# EAGLE design frienship_1 (EAGLE 6.1)
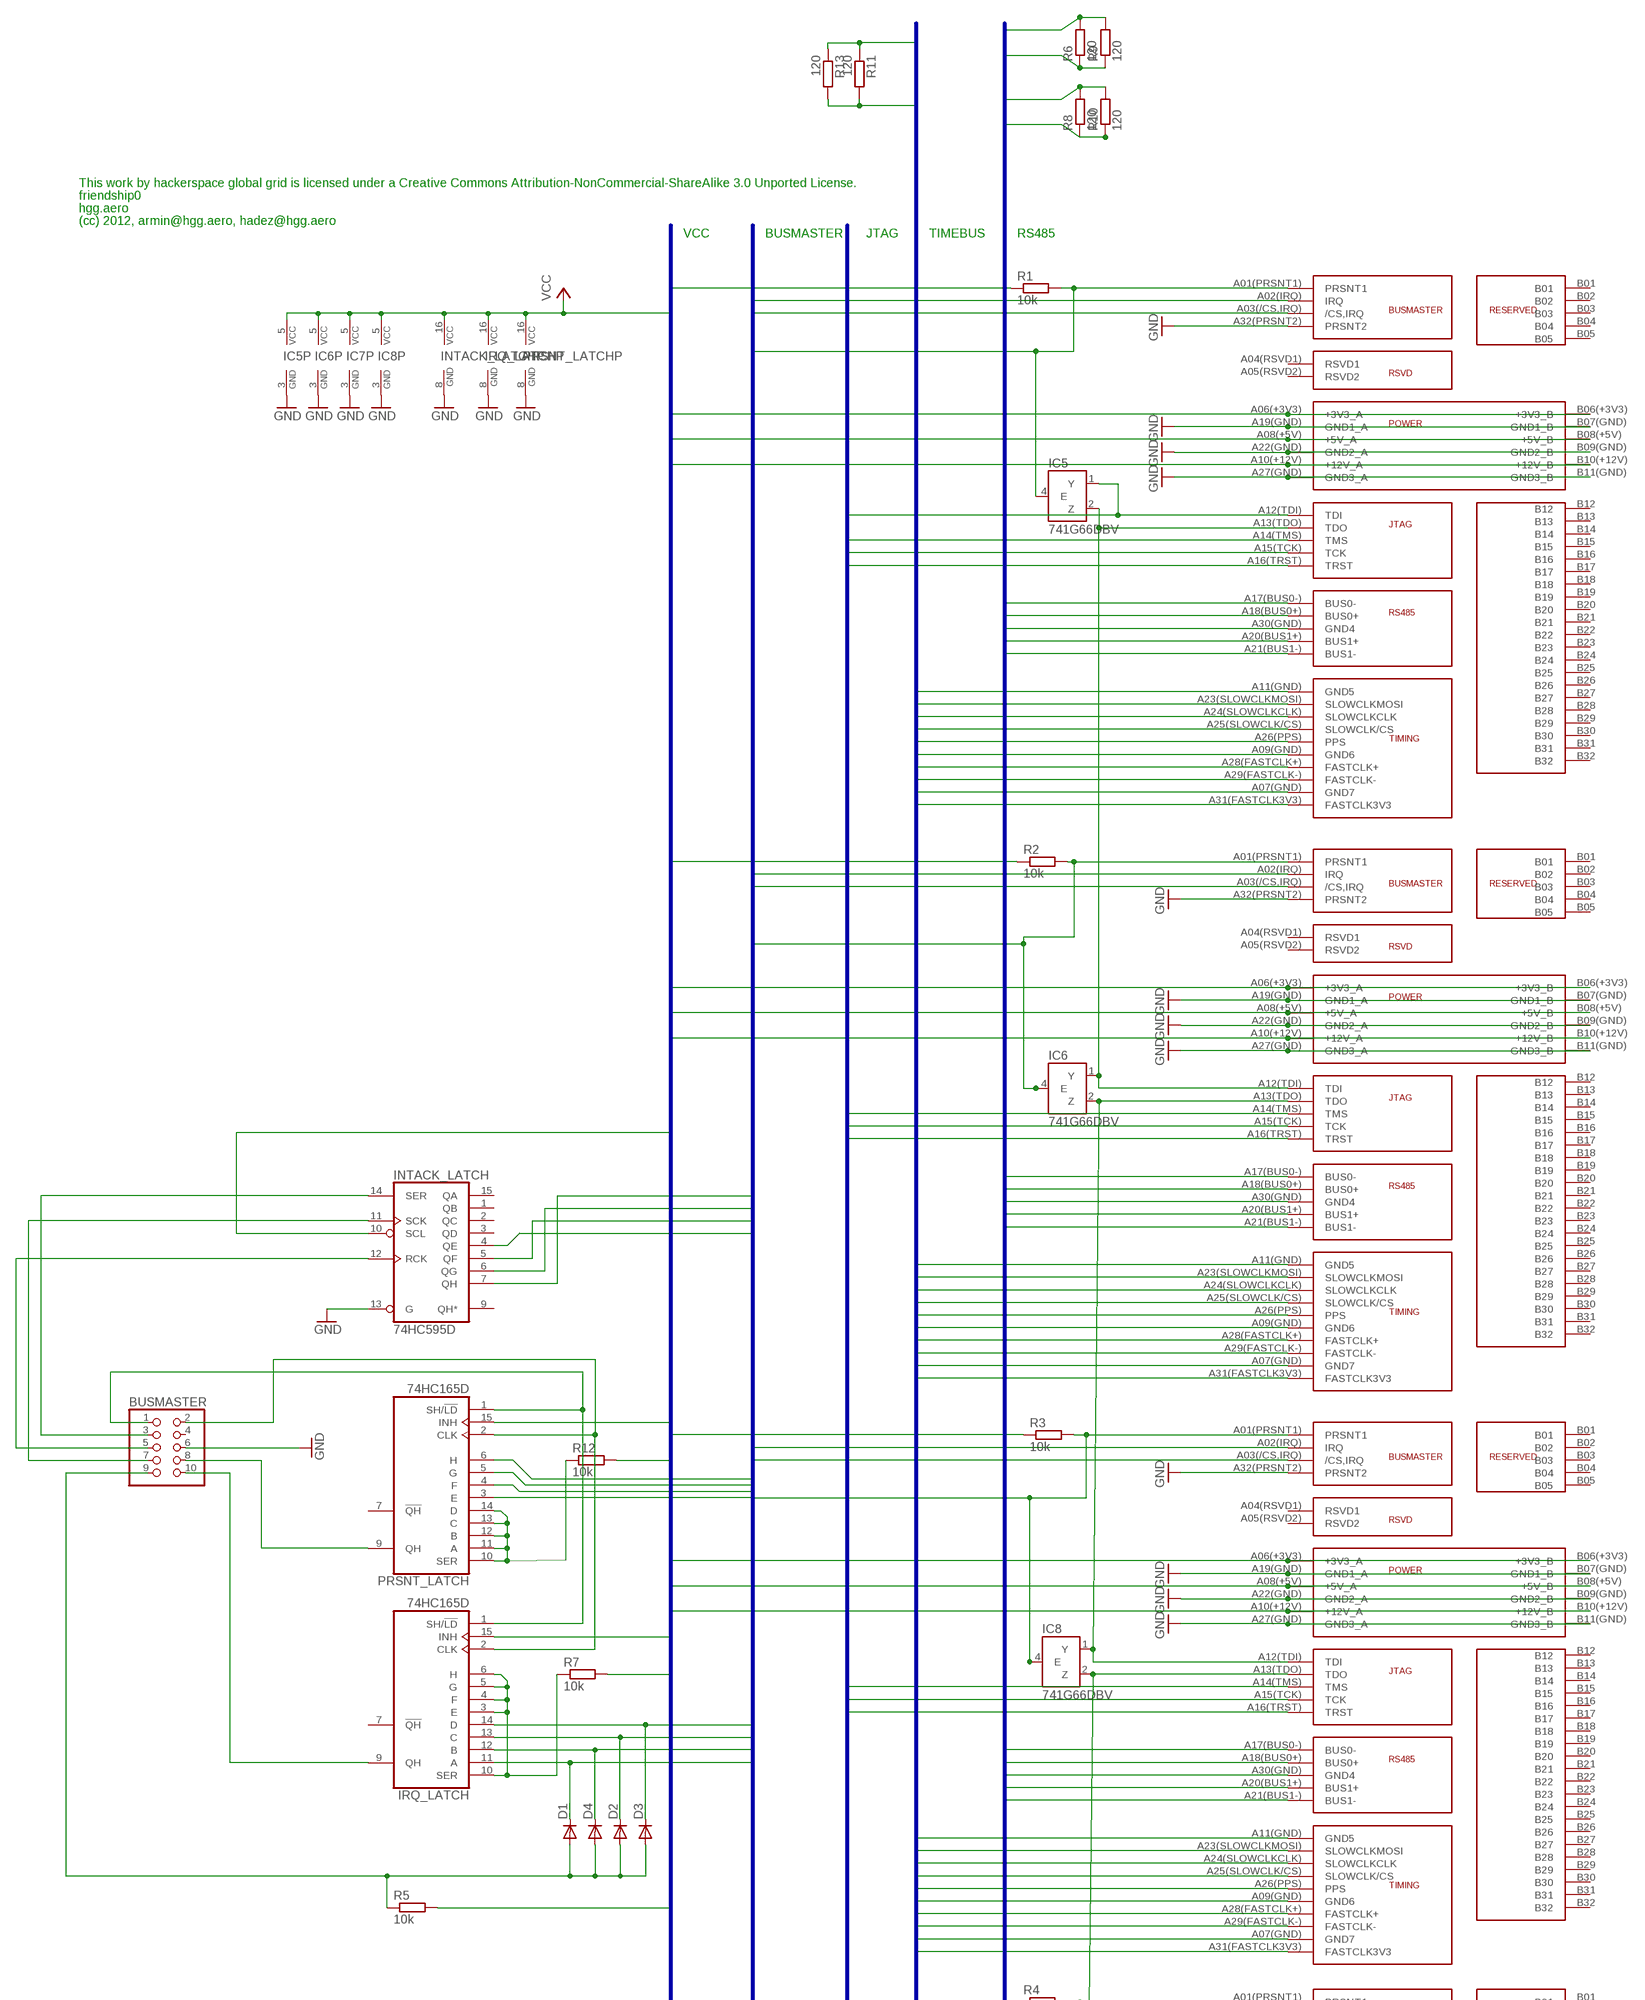
[diagram p0: schematic, sheet 1, part 1 of 2]
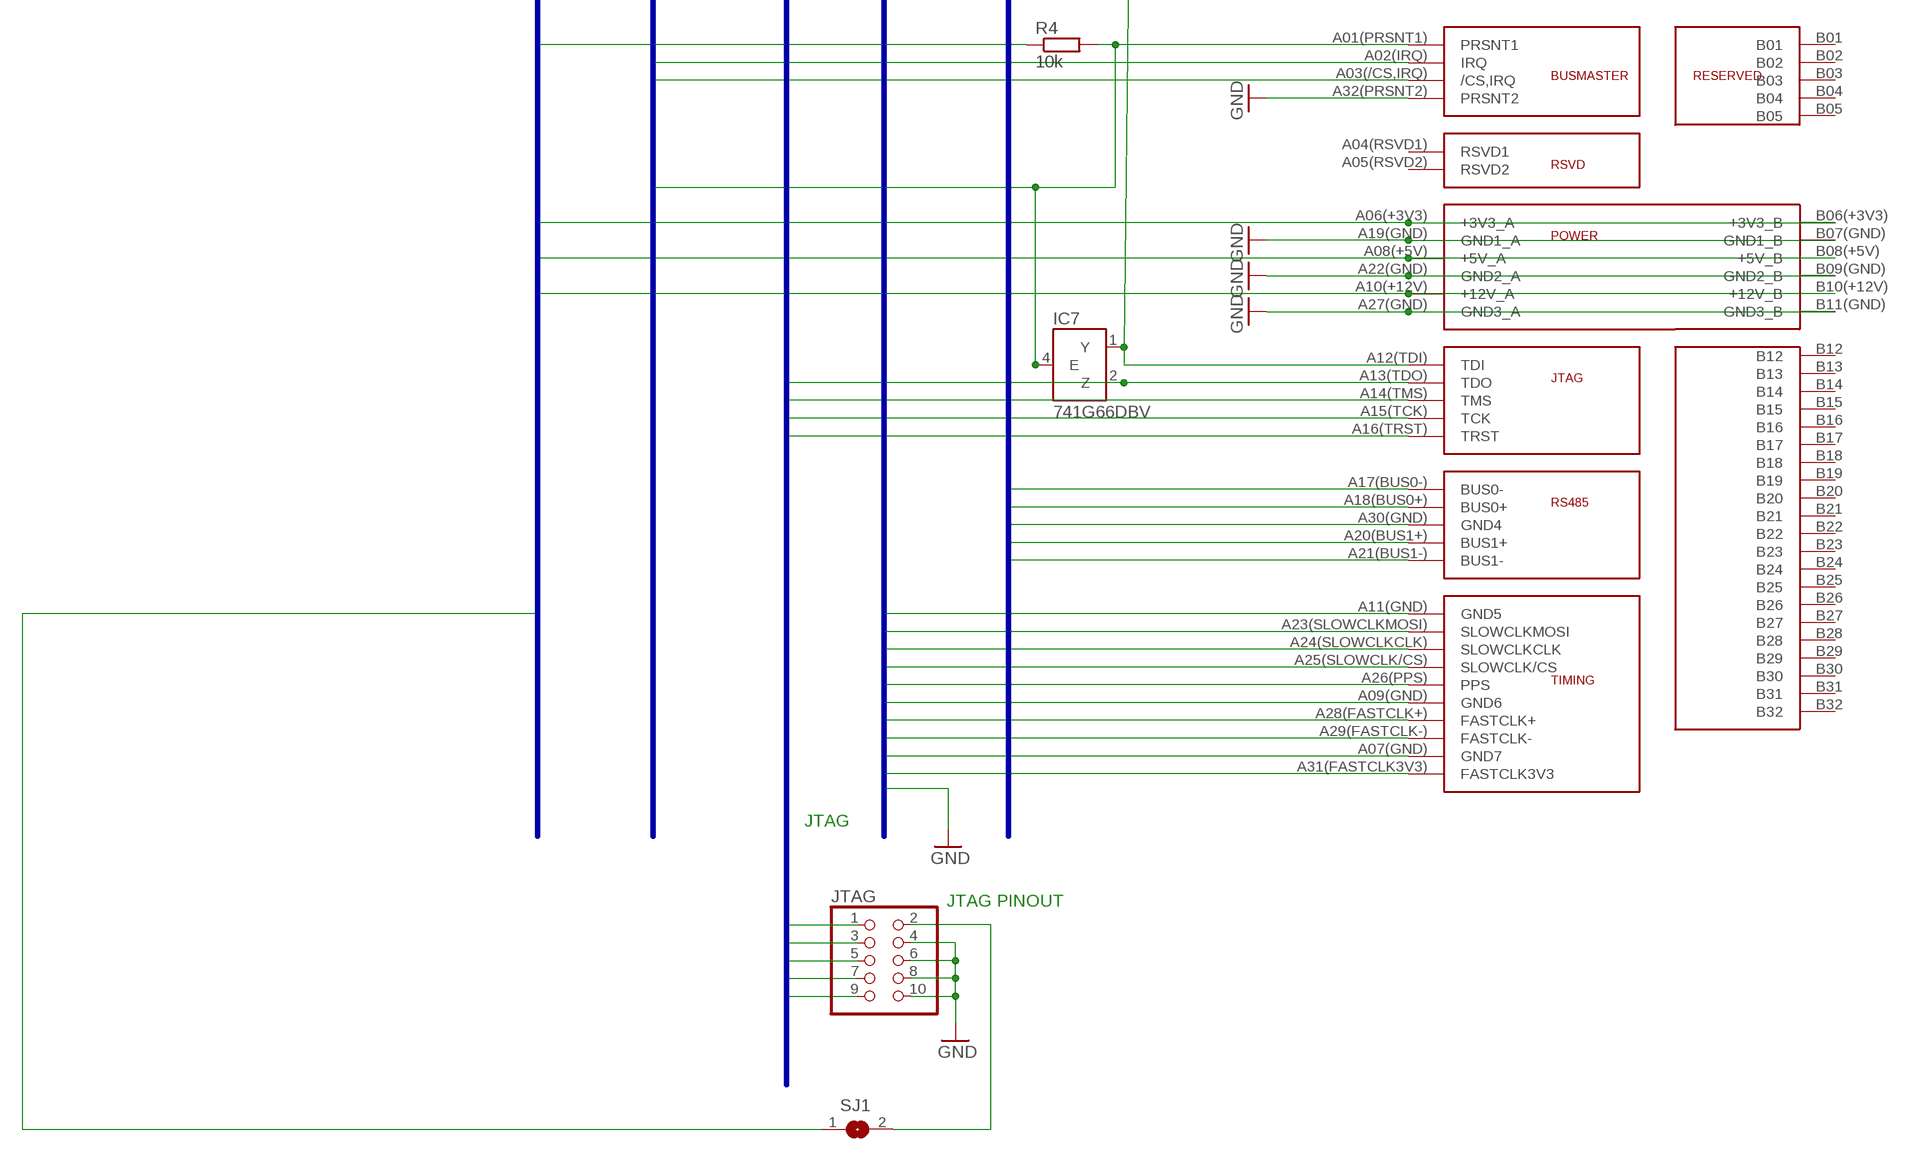
[diagram p1: schematic, sheet 1, part 2 of 2]

## Parts
BUSMASTER  PINHD-2X5  [2X05]
D1  DIODE-SOD80C  [SOD80C]
D2  DIODE-SOD80C  [SOD80C]
D3  DIODE-SOD80C  [SOD80C]
D4  DIODE-SOD80C  [SOD80C]
IC5  741G66DBV  [SOT23-5]
IC6  741G66DBV  [SOT23-5]
IC7  741G66DBV  [SOT23-5]
IC8  741G66DBV  [SOT23-5]
INTACK_LATCH  74HC595D  [SO16]
IRQ_LATCH  74HC165D  [SO16]
JTAG  PINHD-2X5  [2X05]
PORT0  FRIENDSHIPSLOT  [FRIENDSHIP_SLOT]
PORT1  FRIENDSHIPSLOT  [FRIENDSHIP_SLOT]
PORT2  FRIENDSHIPSLOT  [FRIENDSHIP_SLOT]
PORT3  FRIENDSHIPSLOT  [FRIENDSHIP_SLOT]
PRSNT_LATCH  74HC165D  [SO16]
R1  10k  R-EU_R0603  [R0603]
R2  10k  R-EU_R0603  [R0603]
R3  10k  R-EU_R0603  [R0603]
R4  10k  R-EU_R0603  [R0603]
R5  10k  R-EU_R0603  [R0603]
R6  120  R-EU_R0603  [R0603]
R7  10k  R-EU_R0603  [R0603]
R8  120  R-EU_R0603  [R0603]
R9  120  R-EU_R0603  [R0603]
R10  120  R-EU_R0603  [R0603]
R11  120  R-EU_R0603  [R0603]
R12  10k  R-EU_R0603  [R0603]
R13  120  R-EU_R0603  [R0603]
SJ1  SJ  [SJ]

## Nets
3V3: IC5.5(VCC) IC6.5(VCC) IC7.5(VCC) IC8.5(VCC) INTACK_LATCH.10(SCL) INTACK_LATCH.16(VCC) IRQ_LATCH.15(INH) IRQ_LATCH.16(VCC) PORT0.A06(+3V3)(+3V3_A) PORT0.B06(+3V3)(+3V3_B) PORT1.A06(+3V3)(+3V3_A) PORT1.B06(+3V3)(+3V3_B) PORT2.A06(+3V3)(+3V3_A) PORT2.B06(+3V3)(+3V3_B) PORT3.A06(+3V3)(+3V3_A) PORT3.B06(+3V3)(+3V3_B) PRSNT_LATCH.15(INH) PRSNT_LATCH.16(VCC) R1.1 R2.1 R3.1 R4.1 R5.2 R7.2 R12.2 SJ1.1 ; supply symbol labelled VCC
5V: PORT0.A08(+5V)(+5V_A) PORT0.B08(+5V)(+5V_B) PORT1.A08(+5V)(+5V_A) PORT1.B08(+5V)(+5V_B) PORT2.A08(+5V)(+5V_A) PORT2.B08(+5V)(+5V_B) PORT3.A08(+5V)(+5V_A) PORT3.B08(+5V)(+5V_B)
12V: PORT0.A10(+12V)(+12V_A) PORT0.B10(+12V)(+12V_B) PORT1.A10(+12V)(+12V_A) PORT1.B10(+12V)(+12V_B) PORT2.A10(+12V)(+12V_A) PORT2.B10(+12V)(+12V_B) PORT3.A10(+12V)(+12V_A) PORT3.B10(+12V)(+12V_B)
/CS: PORT0.A25(SLOWCLK/CS)(SLOWCLK/CS) PORT1.A25(SLOWCLK/CS)(SLOWCLK/CS) PORT2.A25(SLOWCLK/CS)(SLOWCLK/CS) PORT3.A25(SLOWCLK/CS)(SLOWCLK/CS)
/CS0: INTACK_LATCH.7(QH) PORT0.A03(/CS,IRQ)(/CS,IRQ)
/CS1: INTACK_LATCH.6(QG) PORT1.A03(/CS,IRQ)(/CS,IRQ)
/CS2: INTACK_LATCH.5(QF) PORT2.A03(/CS,IRQ)(/CS,IRQ)
/CS3: INTACK_LATCH.4(QE) PORT3.A03(/CS,IRQ)(/CS,IRQ)
CLK: PORT0.A24(SLOWCLKCLK)(SLOWCLKCLK) PORT1.A24(SLOWCLKCLK)(SLOWCLKCLK) PORT2.A24(SLOWCLKCLK)(SLOWCLKCLK) PORT3.A24(SLOWCLKCLK)(SLOWCLKCLK)
FASTCLK3V3: PORT0.A31(FASTCLK3V3)(FASTCLK3V3) PORT1.A31(FASTCLK3V3)(FASTCLK3V3) PORT2.A31(FASTCLK3V3)(FASTCLK3V3) PORT3.A31(FASTCLK3V3)(FASTCLK3V3)
FASTCLK+: PORT0.A28(FASTCLK+)(FASTCLK+) PORT1.A28(FASTCLK+)(FASTCLK+) PORT2.A28(FASTCLK+)(FASTCLK+) PORT3.A28(FASTCLK+)(FASTCLK+) R11.1 R13.1
FASTCLK-: PORT0.A29(FASTCLK-)(FASTCLK-) PORT1.A29(FASTCLK-)(FASTCLK-) PORT2.A29(FASTCLK-)(FASTCLK-) PORT3.A29(FASTCLK-)(FASTCLK-) R11.2 R13.2
GND: BUSMASTER.6 IC5.3(GND) IC6.3(GND) IC7.3(GND) IC8.3(GND) INTACK_LATCH.8(GND) INTACK_LATCH.13(G) IRQ_LATCH.8(GND) JTAG.4 JTAG.6 JTAG.8 JTAG.10 PORT0.A07(GND)(GND7) PORT0.A09(GND)(GND6) PORT0.A11(GND)(GND5) PORT0.A19(GND)(GND1_A) PORT0.A22(GND)(GND2_A) PORT0.A27(GND)(GND3_A) PORT0.A30(GND)(GND4) PORT0.A32(PRSNT2)(PRSNT2) PORT0.B07(GND)(GND1_B) PORT0.B09(GND)(GND2_B) PORT0.B11(GND)(GND3_B) PORT1.A07(GND)(GND7) PORT1.A09(GND)(GND6) PORT1.A11(GND)(GND5) PORT1.A19(GND)(GND1_A) PORT1.A22(GND)(GND2_A) PORT1.A27(GND)(GND3_A) PORT1.A30(GND)(GND4) PORT1.A32(PRSNT2)(PRSNT2) PORT1.B07(GND)(GND1_B) PORT1.B09(GND)(GND2_B) PORT1.B11(GND)(GND3_B) PORT2.A07(GND)(GND7) PORT2.A09(GND)(GND6) PORT2.A11(GND)(GND5) PORT2.A19(GND)(GND1_A) PORT2.A22(GND)(GND2_A) PORT2.A27(GND)(GND3_A) PORT2.A30(GND)(GND4) PORT2.A32(PRSNT2)(PRSNT2) PORT2.B07(GND)(GND1_B) PORT2.B09(GND)(GND2_B) PORT2.B11(GND)(GND3_B) PORT3.A07(GND)(GND7) PORT3.A09(GND)(GND6) PORT3.A11(GND)(GND5) PORT3.A19(GND)(GND1_A) PORT3.A22(GND)(GND2_A) PORT3.A27(GND)(GND3_A) PORT3.A30(GND)(GND4) PORT3.A32(PRSNT2)(PRSNT2) PORT3.B07(GND)(GND1_B) PORT3.B09(GND)(GND2_B) PORT3.B11(GND)(GND3_B) PRSNT_LATCH.8(GND)
IRQ0: D3.C IRQ_LATCH.14(D) PORT0.A02(IRQ)(IRQ)
IRQ1: D2.C IRQ_LATCH.13(C) PORT1.A02(IRQ)(IRQ)
IRQ2: D4.C IRQ_LATCH.12(B) PORT2.A02(IRQ)(IRQ)
IRQ3: D1.C IRQ_LATCH.11(A) PORT3.A02(IRQ)(IRQ)
MOSI: PORT0.A23(SLOWCLKMOSI)(SLOWCLKMOSI) PORT1.A23(SLOWCLKMOSI)(SLOWCLKMOSI) PORT2.A23(SLOWCLKMOSI)(SLOWCLKMOSI) PORT3.A23(SLOWCLKMOSI)(SLOWCLKMOSI)
N$1: BUSMASTER.3 INTACK_LATCH.14(SER)
N$2: IC5.2(Z) IC6.1(Y) PORT0.A13(TDO)(TDO) PORT1.A12(TDI)(TDI)
N$3: BUSMASTER.1 IRQ_LATCH.1(SH/!LD) PRSNT_LATCH.1(SH/!LD)
N$4: BUSMASTER.7 INTACK_LATCH.11(SCK)
N$5: JTAG.2 SJ1.2
N$6: IC6.2(Z) IC8.1(Y) PORT1.A13(TDO)(TDO) PORT2.A12(TDI)(TDI)
N$7: IC7.1(Y) IC8.2(Z) PORT2.A13(TDO)(TDO) PORT3.A12(TDI)(TDI)
N$8: IRQ_LATCH.3(E) IRQ_LATCH.4(F) IRQ_LATCH.5(G) IRQ_LATCH.6(H) IRQ_LATCH.10(SER) R7.1
N$9: BUSMASTER.5 INTACK_LATCH.12(RCK)
N$10: PRSNT_LATCH.10(SER) PRSNT_LATCH.11(A) PRSNT_LATCH.12(B) PRSNT_LATCH.13(C) PRSNT_LATCH.14(D) R12.1
N$11: BUSMASTER.9 D1.A D2.A D3.A D4.A R5.1
N$13: BUSMASTER.8 PRSNT_LATCH.9(QH)
N$17: BUSMASTER.10 IRQ_LATCH.9(QH)
PPS: PORT0.A26(PPS)(PPS) PORT1.A26(PPS)(PPS) PORT2.A26(PPS)(PPS) PORT3.A26(PPS)(PPS)
PRSNT0: IC5.4(E) PORT0.A01(PRSNT1)(PRSNT1) PRSNT_LATCH.6(H) R1.2
PRSNT1: IC6.4(E) PORT1.A01(PRSNT1)(PRSNT1) PRSNT_LATCH.5(G) R2.2
PRSNT2: IC8.4(E) PORT2.A01(PRSNT1)(PRSNT1) PRSNT_LATCH.4(F) R3.2
PRSNT3: IC7.4(E) PORT3.A01(PRSNT1)(PRSNT1) PRSNT_LATCH.3(E) R4.2
RX+: PORT0.A20(BUS1+)(BUS1+) PORT1.A20(BUS1+)(BUS1+) PORT2.A20(BUS1+)(BUS1+) PORT3.A20(BUS1+)(BUS1+) R8.2 R10.2
RX-: PORT0.A21(BUS1-)(BUS1-) PORT1.A21(BUS1-)(BUS1-) PORT2.A21(BUS1-)(BUS1-) PORT3.A21(BUS1-)(BUS1-) R8.1 R10.1
SHIFT: BUSMASTER.2 IRQ_LATCH.2(CLK) PRSNT_LATCH.2(CLK)
TCK: JTAG.7 PORT0.A15(TCK)(TCK) PORT1.A15(TCK)(TCK) PORT2.A15(TCK)(TCK) PORT3.A15(TCK)(TCK)
TDI: IC5.1(Y) JTAG.1 PORT0.A12(TDI)(TDI)
TDO: IC7.2(Z) JTAG.3 PORT3.A13(TDO)(TDO)
TMS: JTAG.5 PORT0.A14(TMS)(TMS) PORT1.A14(TMS)(TMS) PORT2.A14(TMS)(TMS) PORT3.A14(TMS)(TMS)
TRST: JTAG.9 PORT0.A16(TRST)(TRST) PORT1.A16(TRST)(TRST) PORT2.A16(TRST)(TRST) PORT3.A16(TRST)(TRST)
TX+: PORT0.A18(BUS0+)(BUS0+) PORT1.A18(BUS0+)(BUS0+) PORT2.A18(BUS0+)(BUS0+) PORT3.A18(BUS0+)(BUS0+) R6.2 R9.2
TX-: PORT0.A17(BUS0-)(BUS0-) PORT1.A17(BUS0-)(BUS0-) PORT2.A17(BUS0-)(BUS0-) PORT3.A17(BUS0-)(BUS0-) R6.1 R9.1
Unconnected: BUSMASTER.4 INTACK_LATCH.1(QB) INTACK_LATCH.2(QC) INTACK_LATCH.3(QD) INTACK_LATCH.9(QH*) INTACK_LATCH.15(QA) IRQ_LATCH.7(!QH) PORT0.A04(RSVD1)(RSVD1) PORT0.A05(RSVD2)(RSVD2) PORT0.B01 PORT0.B02 PORT0.B03 PORT0.B04 PORT0.B05 PORT0.B12 PORT0.B13 PORT0.B14 PORT0.B15 PORT0.B16 PORT0.B17 PORT0.B18 PORT0.B19 PORT0.B20 PORT0.B21 PORT0.B22 PORT0.B23 PORT0.B24 PORT0.B25 PORT0.B26 PORT0.B27 PORT0.B28 PORT0.B29 PORT0.B30 PORT0.B31 PORT0.B32 PORT1.A04(RSVD1)(RSVD1) PORT1.A05(RSVD2)(RSVD2) PORT1.B01 PORT1.B02 PORT1.B03 PORT1.B04 PORT1.B05 PORT1.B12 PORT1.B13 PORT1.B14 PORT1.B15 PORT1.B16 PORT1.B17 PORT1.B18 PORT1.B19 PORT1.B20 PORT1.B21 PORT1.B22 PORT1.B23 PORT1.B24 PORT1.B25 PORT1.B26 PORT1.B27 PORT1.B28 PORT1.B29 PORT1.B30 PORT1.B31 PORT1.B32 PORT2.A04(RSVD1)(RSVD1) PORT2.A05(RSVD2)(RSVD2) PORT2.B01 PORT2.B02 PORT2.B03 PORT2.B04 PORT2.B05 PORT2.B12 PORT2.B13 PORT2.B14 PORT2.B15 PORT2.B16 PORT2.B17 PORT2.B18 PORT2.B19 PORT2.B20 PORT2.B21 PORT2.B22 PORT2.B23 PORT2.B24 PORT2.B25 PORT2.B26 PORT2.B27 PORT2.B28 PORT2.B29 PORT2.B30 PORT2.B31 PORT2.B32 PORT3.A04(RSVD1)(RSVD1) PORT3.A05(RSVD2)(RSVD2) PORT3.B01 PORT3.B02 PORT3.B03 PORT3.B04 PORT3.B05 PORT3.B12 PORT3.B13 PORT3.B14 PORT3.B15 PORT3.B16 PORT3.B17 PORT3.B18 PORT3.B19 PORT3.B20 PORT3.B21 PORT3.B22 PORT3.B23 PORT3.B24 PORT3.B25 PORT3.B26 PORT3.B27 PORT3.B28 PORT3.B29 PORT3.B30 PORT3.B31 PORT3.B32 PRSNT_LATCH.7(!QH)

## Buses
IRQ0,IRQ1,IRQ2,IRQ3,/CS0,/CS1,/CS2,/CS3,PRSNT0,PRSNT1,PRSNT2,PRSNT3
TDI,TDO,TMS,TCK,TRST
GND,MOSI,CLK,/CS,PPS,FASTCLK+,FASTCLK-,FASTCLK3V3
TX+,TX-,GND,RX+,RX-
3V3,5V,12V

## Notes on the sheet
- This work by hackerspace global grid is licensed under a Creative Commons Attribution-NonCommercial-ShareAlike 3.0 Unported License.
- friendship0
- hgg.aero
- (cc) 2012, armin@hgg.aero, hadez@hgg.aero
- VCC | BUSMASTER | JTAG | TIMEBUS | RS485
- JTAG
- JTAG PINOUT

## Library data of the parts
BUSMASTER JTAG = pinhead:PINHD-2X5: PIN HEADER
D1-D4 = diode:DIODE-: DIODE
IC5-IC8 = 74xx-little-de:74*1G66: Single Analog / Bilateral Switch Source: http://www.semiconductors.philips.com/acrobat_download/datasheets/74HC_HCT1G66_3.pdf
INTACK_LATCH = 74xx-eu:74*595: 8-bit SHIFT REGISTER, output latch
IRQ_LATCH PRSNT_LATCH = 74xx-eu:74*165: 8-bit parallel load SHIFT REGISTER
PORT0 PORT1-PORT3 = hgg:FRIENDSHIP
R1-R13 = rcl:R-EU_: RESISTOR, European symbol
SJ1 = jumper:SJ: SMD solder JUMPER

## Board
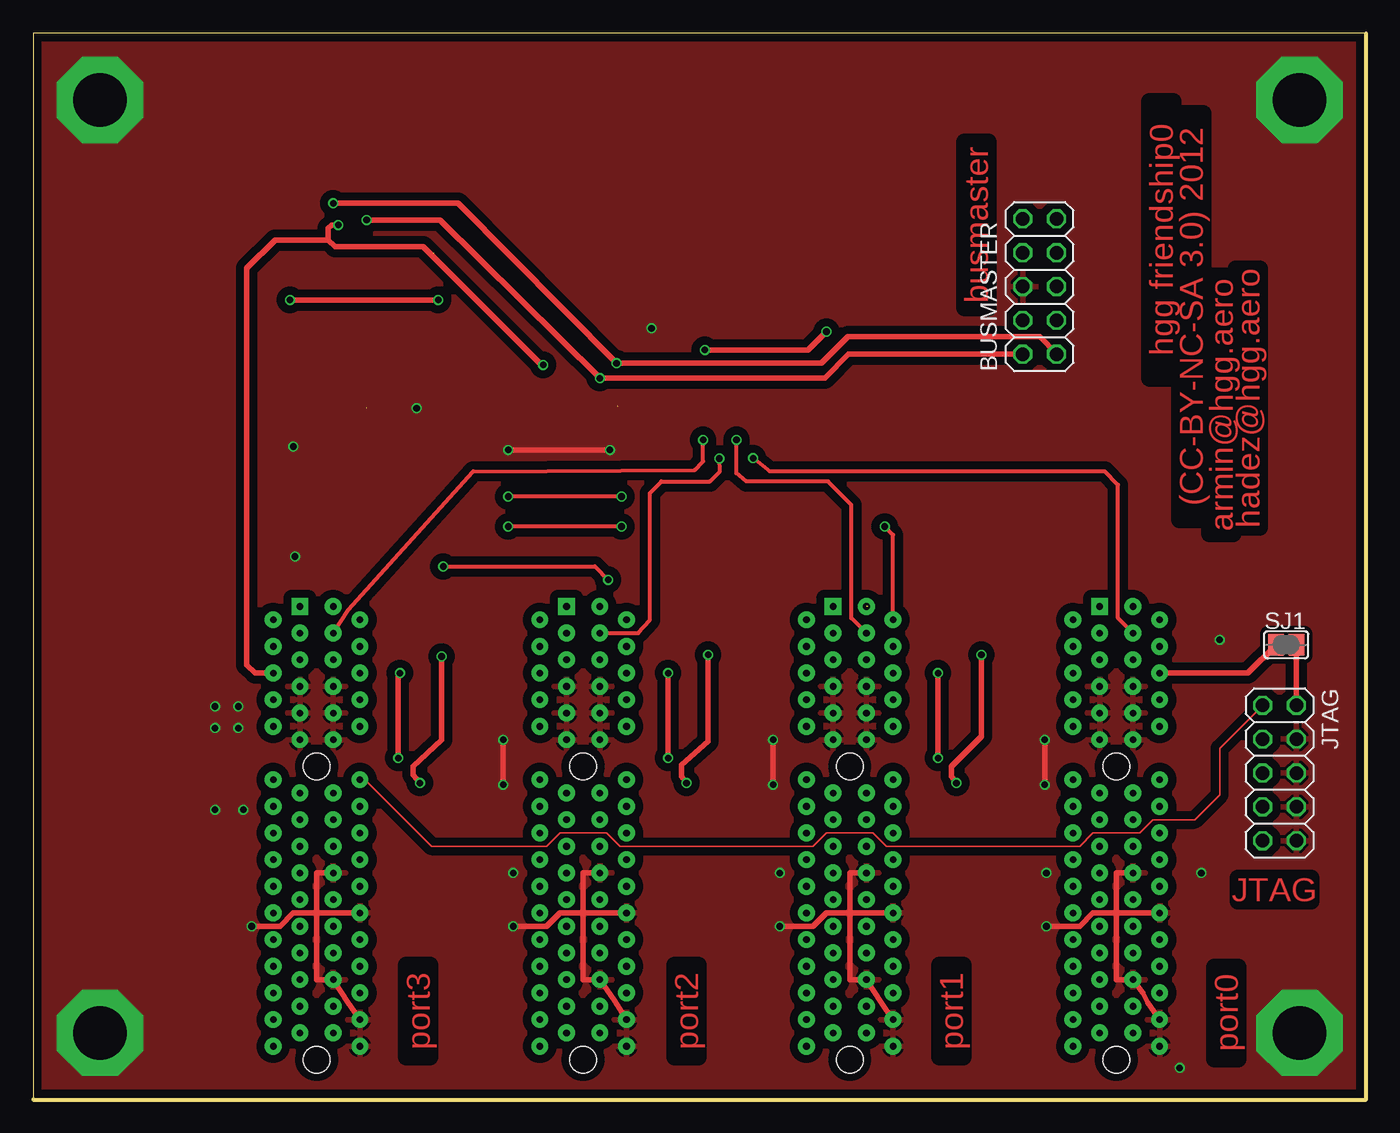
[diagram p2: board, top side]
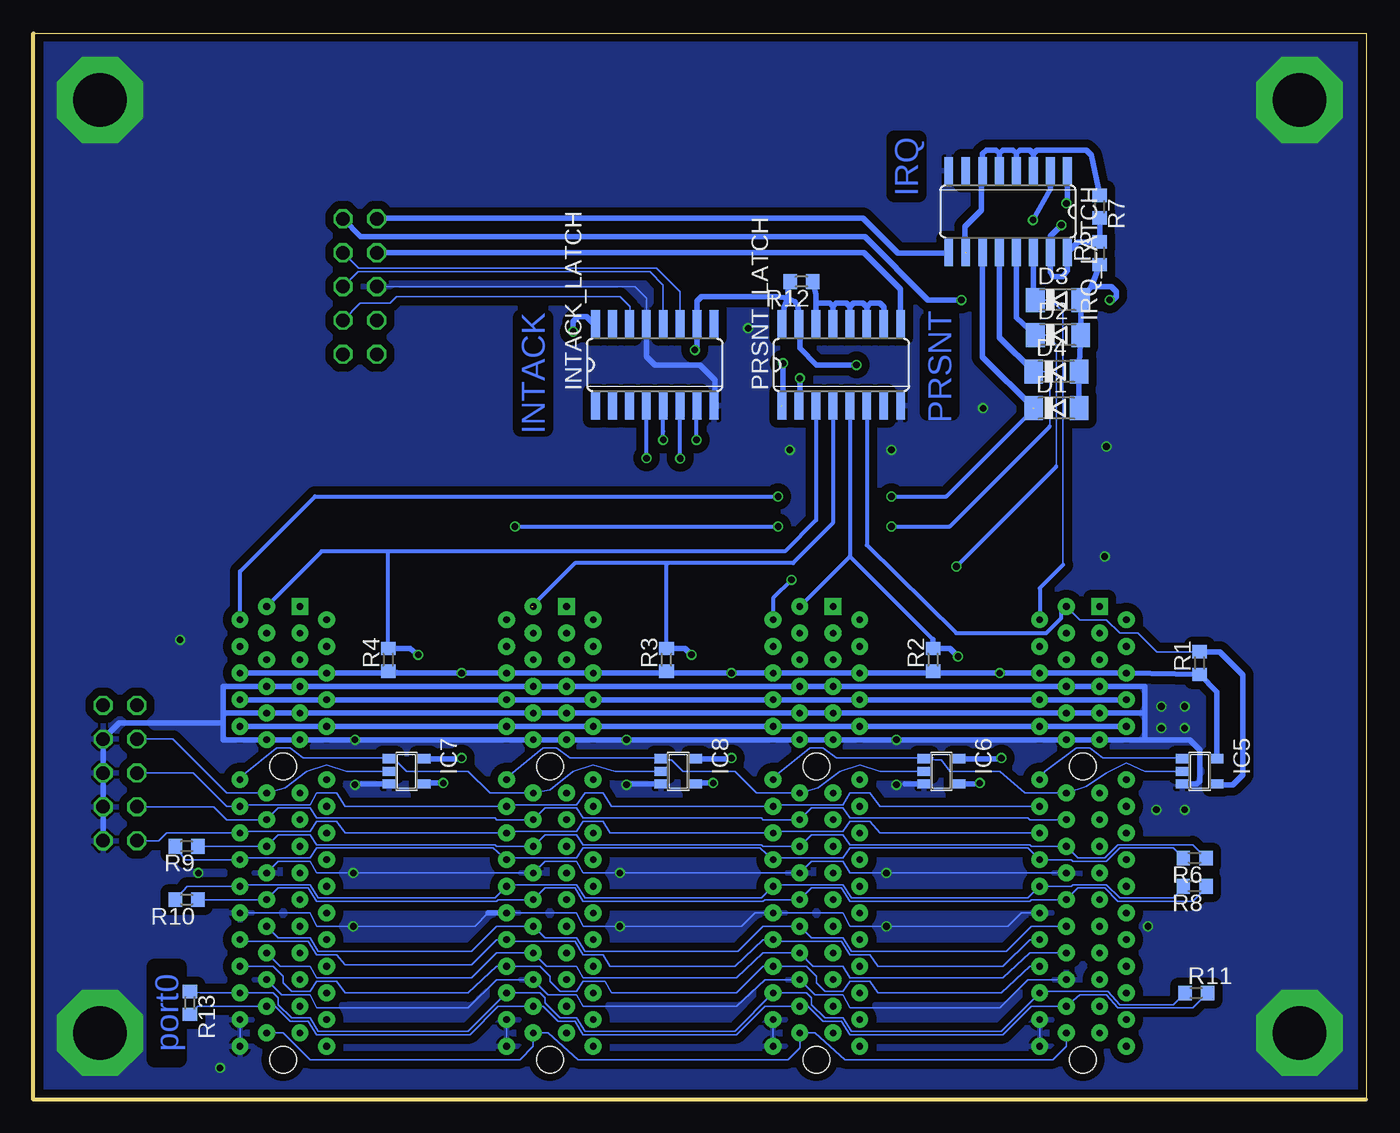
[diagram p3: board, bottom side, seen from below]

Size 100 x 80 mm. Coordinates in mm from the lower left corner, seen from the top.
Outline: 0,0 100,0 100,80 0,80 0,0
Copper layers (1*16): Top 0.035mm / dielectric 1.5mm / Bottom 0.035mm
Design rules: minimum track width 0.125mm, minimum drill 0.2mm, track to track 0.125mm, track to pad 0.125mm, pad to pad 0.125mm, via to via 0.125mm, smd to smd 0.125mm, copper to edge 0.3mm, drill to drill 0.2mm, minimum pad ring 0.2mm, minimum via ring 0.125mm, stop-mask expansion 0.075mm, vias tented up to drill 0mil, thermal gap 0.2mm

### Footprints (pad centres in the part's own frame; a part is rotated, then mirrored left to right if it is on the bottom)
2X05 = drill 1.016 octagon: 1 -5.08,-1.27; 2 -5.08,1.27; 3 -2.54,-1.27; 4 -2.54,1.27; 5 0,-1.27; 6 0,1.27; 7 2.54,-1.27; 8 2.54,1.27; 9 5.08,-1.27; 10 5.08,1.27
SOD80C = smd 1.4 x 1.8: A 1.7,0; C -1.7,0
SOT23-5 = smd 0.69 x 0.99: 1 -0.95,-1.29; 2 0,-1.29; 3 0.95,-1.29; 4 0.95,1.3; 5 -0.95,1.3
SO16 = smd 0.66 x 2.032: 1 -4.445,-3.073; 2 -3.175,-3.073; 3 -1.905,-3.073; 4 -0.635,-3.073; 5 0.635,-3.073; 6 1.905,-3.073; 7 3.175,-3.073; 8 4.445,-3.073; 9 4.445,3.073; 10 3.175,3.073; 11 1.905,3.073; 12 0.635,3.073; 13 -0.635,3.073; 14 -1.905,3.073; 15 -3.175,3.073; 16 -4.445,3.073
FRIENDSHIP_SLOT = drill 0.5 pad 1.27: A01(PRSNT1) 0,2.5; A02(IRQ) 1,4.5; A03(/CS,IRQ) 2,2.5; A04(RSVD1) 3,4.5; A05(RSVD2) 4,2.5; A06(+3V3) 5,4.5; A07(GND) 6,2.5; A08(+5V) 7,4.5; A09(GND) 8,2.5; A10(+12V) 9,4.5; A11(GND) 10,2.5; A12(TDI) 13,4.5; A13(TDO) 14,2.5; A14(TMS) 15,4.5; A15(TCK) 16,2.5; A16(TRST) 17,4.5; A17(BUS0-) 18,2.5; A18(BUS0+) 19,4.5; A19(GND) 20,2.5; A20(BUS1+) 21,4.5; A21(BUS1-) 22,2.5; A22(GND) 23,4.5; A23(SLOWCLKMOSI) 24,2.5; A24(SLOWCLKCLK) 25,4.5; A25(SLOWCLK/CS) 26,2.5; A26(PPS) 27,4.5; A27(GND) 28,2.5; A28(FASTCLK+) 29,4.5; A29(FASTCLK-) 30,2.5; A30(GND) 31,4.5; A31(FASTCLK3V3) 32,2.5; A32(PRSNT2) 33,4.5; B02 1,-2; B03 2,0; B04 3,-2; B05 4,0; B06(+3V3) 5,-2; B07(GND) 6,0; B08(+5V) 7,-2; B09(GND) 8,0; B10(+12V) 9,-2; B11(GND) 10,0; B12 13,-2; B13 14,0; B14 15,-2; B15 16,0; B16 17,-2; B17 18,0; B18 19,-2; B19 20,0; B20 21,-2; B21 22,0; B22 23,-2; B23 24,0; B24 25,-2; B25 26,0; B26 27,-2; B27 28,0; B28 29,-2; B29 30,0; B30 31,-2; B31 32,0; B32 33,-2 | drill 0.5 pad 1.27 square: B01 0,0 | hole 2: 12,1.25; 34,1.25
R0603 = smd 1 x 1.1: 1 -0.85,0; 2 0.85,0
SJ = smd 1.168 x 1.6: 1 -0.762,0; 2 0.762,0

### Placement (x,y rotation side)
BUSMASTER  75.5,61 90 top
D1  23.25,51.88 0 bottom
D2  23.12,57.38 0 bottom
D3  23.12,60 0 bottom
D4  23.25,54.62 0 bottom
IC5  12.5,24.62 270 bottom
IC6  31.88,24.62 270 bottom
IC7  72,24.62 270 bottom
IC8  51.62,24.62 270 bottom
INTACK_LATCH  53.38,55.12 0 bottom
IRQ_LATCH  26.88,66.62 180 bottom
JTAG  93.5,24.5 270 top
PORT0  20,37 270 top
PORT1  40,37 270 top
PORT2  60,37 270 top
PORT3  80,37 270 top
PRSNT_LATCH  39.38,55.12 0 bottom
R1  12.5,32.75 90 bottom
R2  32.5,33 90 bottom
R3  52.5,33 90 bottom
R4  73.38,33 90 bottom
R5  20,63.5 90 bottom
R6  12.88,18.12 180 bottom
R7  20,67 270 bottom
R8  12.88,16 180 bottom
R9  88.5,19 180 bottom
R10  88.5,15 180 bottom
R11  12.75,8 0 bottom
R12  42.38,61.38 180 bottom
R13  88.25,7.25 270 bottom
SJ1  94,34.12 0 top

### Tracks (layer width: path | path; a pad name or v marks a point on that pad's centre or on a via)
3V3  (via drill 0.5)
  Top 0.406: SJ1.1 91.11,32 PORT3.A06(+3V3) | v47.62,25.62 v47.62,32 | v67.88,25.62 v67.88,32 | v27.38,25.62 27.38,31.88 v27.5,32 | v22.88,65.62 22.38,65.62 22.12,65.38 22.12,64.5 | 22.12,64.5 22.62,64 29.25,64 38.12,55.12 v38.25,55.12 | v50.38,56.25 58.12,56.25 v59.5,57.62 | 22.12,64.5 18.12,64.5 16,62.38 16,32.62 16.62,32 PORT0.B06(+3V3)
  Bottom 0.125: 42.5,58.25 42.62,58.12 42.5,58.12 | R12.2 43.38,61.23
  Bottom 0.406: R7.2 R5.2 21.63,64.35 IRQ_LATCH.16 22.43,62.2 22.75,61.75 23.5,61.75 23.7,62.08 IRQ_LATCH.15 23.7,64.8 v22.88,65.62 | PORT3.A06(+3V3) PORT3.B06(+3V3) | PORT3.B06(+3V3) v67.88,32 PORT2.A06(+3V3) PORT2.B06(+3V3) | PORT2.B06(+3V3) v47.62,32 PORT1.A06(+3V3) PORT1.B06(+3V3) | PORT1.B06(+3V3) v27.5,32 PORT0.A06(+3V3) PORT0.B06(+3V3) R1.1 11.2,30.6 IC5.5 | PORT1.B06(+3V3) 32.5,32 R2.1 | PORT2.B06(+3V3) 52.5,32 R3.1 | PORT3.B06(+3V3) 72.5,32 R4.1 | IC8.5 47.67,25.57 v47.62,25.62 | IC7.5 67.92,25.57 v67.88,25.62 | IC6.5 27.43,25.57 v27.38,25.62 | PRSNT_LATCH.16 43.7,59.43 43.38,60.12 | 43.38,60.12 42.88,59.88 42.62,59.5 42.5,58.25 42.5,58.12 | 43.38,61.23 43.38,60.12 | v38.25,55.12 41.25,55.12 42.5,56.38 42.5,58.12 | PRSNT_LATCH.15 42.55,58.17 42.5,58.12 | 43.38,60.12 44.25,60.25 49.88,60.25 50.2,59.92 INTACK_LATCH.10 50.2,56.42 v50.38,56.25 | v59.5,57.62 59.5,58.38 59.12,58.75 58.5,58.75 57.95,58.2 | 57.95,58.2 57.88,58.12 57.75,58.12 | INTACK_LATCH.16 57.95,58.2
5V
  Bottom 0.406: PORT0.B08(+5V) PORT0.A08(+5V) PORT1.B08(+5V) PORT1.A08(+5V) PORT2.B08(+5V) PORT2.A08(+5V) PORT3.B08(+5V) PORT3.A08(+5V)
12V
  Bottom 0.406: PORT0.B10(+12V) PORT0.A10(+12V) PORT1.B10(+12V) PORT1.A10(+12V) PORT2.B10(+12V) PORT2.A10(+12V) PORT3.B10(+12V) PORT3.A10(+12V)
/CS
  Bottom 0.125: PORT3.A25(SLOWCLK/CS) 81.5,10 79.25,10 78.75,9.12 67.12,9.12 65.25,11 PORT2.A25(SLOWCLK/CS) 61.5,10 59.25,10 58.75,9.12 47.25,9.12 45.25,11 PORT1.A25(SLOWCLK/CS) 41.5,10 39.25,10 38.75,9.12 27.25,9.12 25.25,11 PORT0.A25(SLOWCLK/CS)
/CS0  (via drill 0.5)
  Top 0.305: PORT0.A03(/CS,IRQ) 23.62,36.75 33,47.12 49.62,47.25 50.25,47.88 v50.25,49.5
  Bottom 0.305: v50.25,49.5 50.25,50.12 arc3 INTACK_LATCH.7
/CS1  (via drill 0.5)
  Top 0.305: v51.47,48.09 51.5,47.12 50.75,46.38 47.12,46.38 46.25,45.5 46.25,36 45.38,35 PORT1.A03(/CS,IRQ)
  Bottom 0.305: v51.47,48.09 INTACK_LATCH.6
/CS2  (via drill 0.5)
  Top 0.305: PORT2.A03(/CS,IRQ) 61.38,36.12 61.38,44.62 59.62,46.38 53.5,46.38 52.75,47 v52.75,49.5
  Bottom 0.305: v52.75,49.5 52.74,50.13 INTACK_LATCH.5
/CS3  (via drill 0.5)
  Top 0.305: PORT3.A03(/CS,IRQ) 81.38,36.12 81.38,46.12 80.38,47.12 55.25,47.12 v54,48.12
  Bottom 0.305: v54,48.12 54.01,49.49 INTACK_LATCH.4
CLK
  Bottom 0.125: PORT3.A24(SLOWCLKCLK) 84.38,11.88 79.38,11.88 78.75,10.88 77.25,10.88 76.62,10.12 67.12,10.12 65.25,12 PORT2.A24(SLOWCLKCLK) 64.38,11.88 59.38,11.88 58.75,10.88 57.25,10.88 56.75,10 47.38,10 45.25,12 PORT1.A24(SLOWCLKCLK) 44.38,11.88 39.38,11.88 38.75,10.88 37.25,10.88 36.62,10 27.25,10 25.25,12 PORT0.A24(SLOWCLKCLK)
FASTCLK3V3
  Bottom 0.125: PORT3.A31(FASTCLK3V3) 81.25,5 79.25,3 63.5,3 62.5,4 PORT2.A31(FASTCLK3V3) 61.38,5 59.12,3 43.38,3 42.5,3.88 PORT1.A31(FASTCLK3V3) 41.38,5 39.12,3 23.5,3 22.5,4 PORT0.A31(FASTCLK3V3)
FASTCLK+
  Bottom 0.125: R13.1 87.5,8 PORT3.A28(FASTCLK+) 82,8 81.62,7.62 81.62,7.12 80.62,6.12 79.25,6.12 78.62,5.12 67.38,5.12 PORT2.A28(FASTCLK+) 62,8 61.62,7.62 61.62,7.25 60.5,6.12 59.25,6.12 58.62,5.12 47.38,5.12 PORT1.A28(FASTCLK+) 42,8 41.62,7.62 41.62,7.12 40.62,6.12 39.25,6.12 38.62,5.12 27.38,5.12 PORT0.A28(FASTCLK+) 24.12,8.12 19.38,8.12 18.5,7.12 14.47,7.12 R11.1
FASTCLK-
  Bottom 0.125: R13.2 87.65,7 PORT3.A29(FASTCLK-) 81.88,7 80.75,5.88 79.38,5.88 78.75,4.88 67.25,4.88 65.12,7 PORT2.A29(FASTCLK-) 61.75,7 60.62,5.88 59.38,5.88 58.75,4.88 47.25,4.88 45.12,7 PORT1.A29(FASTCLK-) 41.88,7 40.75,5.88 39.38,5.88 38.75,4.88 27.25,4.88 25.12,7 PORT0.A29(FASTCLK-) 21.5,7.88 19.5,7.88 18.62,6.88 13.03,6.88 R11.2
GND  (via drill 0.5, 4 pad 6.45)
  Top 0.406: v35.25,23.62 v35.25,27 | v55.5,23.62 v55.5,27 | v75.88,23.62 v75.88,27 | v35.62,48.75 v43.25,48.75 | PORT2.A30(GND) 63.62,7.25 PORT2.A27(GND) 61.25,9 61.25,14 | PORT1.A30(GND) 43.62,7.38 PORT1.A27(GND) 41.25,9 41.25,14 | PORT0.A30(GND) 23.62,7.25 PORT0.A27(GND) 21.25,9 21.25,14 | PORT3.A30(GND) 83.62,7.25 83.25,8 PORT3.A27(GND) 81.25,9 81.25,14 | 21.25,14 21.25,17 PORT0.A19(GND) | PORT0.A22(GND) 21.25,14 | 41.25,14 PORT1.A22(GND) | 41.25,14 41.25,17 PORT1.A19(GND) | 61.25,14 61.25,17 PORT2.A19(GND) | 61.25,14 PORT2.A22(GND) | 81.25,14 81.25,17 PORT3.A19(GND) | 81.25,14 PORT3.A22(GND) | 21.25,14 19.5,14 18.5,13 v16.38,13 | 41,14 39.5,14 38.5,13 v36,13 | 61.12,14 59.5,14 58.5,13 v56,13 | 81.12,14 79.5,14 78.5,13 v76,13
  Bottom 0.125: PORT3.A22(GND) 79.25,14 78.75,13 v76,13 66.88,13 65.88,14 | PORT2.A22(GND) 59.25,14 58.75,13 v56,13 46.88,13 45.88,14 PORT1.A22(GND) 39.25,14 38.75,13 v36,13 26.88,13 25.88,14 PORT0.A22(GND) | PORT0.A19(GND) v36,17 38.75,17 39.25,17.88 41.62,17.88 PORT1.A19(GND) v56,17 58.75,17 59.25,17.88 61.62,17.88 PORT2.A19(GND) v76,17 78.75,17 79.25,17.88 81.62,17.88 PORT3.A19(GND) | PORT3.A27(GND) 81.38,7.88 79.25,7.88 78.75,6.88 67.38,6.88 65.25,9 PORT2.A27(GND) 61.38,7.88 59.25,7.88 58.75,7 47.25,7 45.12,9 PORT1.A27(GND) 41.38,7.88 39.25,7.88 38.75,6.88 27.5,6.88 25.38,9 PORT0.A27(GND) | PORT3.A32(PRSNT2) PORT3.A30(GND) | PORT2.A32(PRSNT2) PORT2.A30(GND) | PORT1.A32(PRSNT2) PORT1.A30(GND) | PORT0.A32(PRSNT2) PORT0.A30(GND) | 34.62,23.68 v35.25,23.62 | 55.5,23.68 v55.5,23.62 | 75.38,23.68 v75.88,23.62 | BUSMASTER.6 54.88,61 54,60.12 INTACK_LATCH.13
  Bottom 0.406: 62.75,31 PORT2.A07(GND) PORT2.B07(GND) PORT1.A07(GND) PORT1.B07(GND) PORT0.A07(GND) PORT0.B07(GND) 16.62,31 16.62,29 | 62.75,31 62.75,31.12 | 62.75,31 PORT3.B07(GND) PORT3.A07(GND) 85.75,31 85.75,29 | 85.75,29 PORT3.A09(GND) PORT3.B09(GND) PORT2.A09(GND) PORT2.B09(GND) PORT1.A09(GND) PORT1.B09(GND) PORT0.A09(GND) PORT0.B09(GND) | 85.75,29 85.75,28.25 | 85.75,28.25 85.75,27 PORT3.A11(GND) PORT3.B11(GND) v75.88,27 PORT2.A11(GND) PORT2.B11(GND) v55.5,27 PORT1.A11(GND) PORT1.B11(GND) v35.25,27 PORT0.A11(GND) PORT0.B11(GND) 16.62,27 | 16.62,27 16.62,29 | PORT0.B09(GND) 20,28.88 | PORT0.B09(GND) 16.62,29 | JTAG.10 JTAG.8 JTAG.6 JTAG.4 93.56,28.25 85.75,28.25 | IC6.3 34.62,23.68 | IC8.3 55.5,23.68 | IC7.3 75.38,23.68 | IC5.3 12.7,23.68 12.5,23.88 12.5,26.25 13.25,27 16.62,27 | INTACK_LATCH.13 54,55.75 53.38,55.12 50,55.12 48.88,54 48.88,52 | 65.88,14 PORT2.A22(GND)
  other vias: 13.62,29.5 15.38,29.5 15.38,27.88 13.62,27.88 13.62,21.75 15.75,21.75 46.38,57.88 89,34.5 87.62,17 86,2.38 19.5,49 19.62,40.75 28.75,51.88 95,5 95,75 5,75 5,5
  pour Bottom (isolate 0.61): 0.25,0.38 0.25,79.75 99.88,79.75 99.88,0.12
  pour Top (isolate 0.61): 0.25,0.25 0.25,79.75 99.88,79.75 99.88,0.12
IRQ0
  Bottom 0.125: 24.97,60.02 D3.C 23.62,60 22.75,59.12 22.75,40.12
  Bottom 0.305: 22.75,40.12 24.5,38.38 PORT0.A02(IRQ)
  Bottom 0.406: IRQ_LATCH.14 24.97,60.02
IRQ1  (via drill 0.5)
  Top 0.305: v30.75,40 42.12,40 v43.12,39
  Bottom 0.125: D2.C 24,57.38 23.25,56.62 23.25,47.5
  Bottom 0.305: 23.25,47.5 v30.75,40 | v43.12,39 44.5,37.62 PORT1.A02(IRQ)
  Bottom 0.406: IRQ_LATCH.13 26.24,58.66 D2.C
IRQ2  (via drill 0.5)
  Top 0.305: PORT2.A02(IRQ) 64.5,42.38 v63.88,43 | v44.12,43 v35.62,43
  Bottom 0.125: D4.C 24.12,54.62 23.75,54.25 23.75,50.5
  Bottom 0.305: v63.88,43 v44.12,43 | v35.62,43 31.25,43 23.75,50.5
  Bottom 0.406: IRQ_LATCH.12 27.51,57.19 D4.C
IRQ3  (via drill 0.5)  (1 unrouted)
  Top 0.305: v44.12,45.25 v35.62,45.25
  Bottom 0.305: PORT3.A02(IRQ) 84.5,39.62 78.88,45.25 v44.12,45.25 | v35.62,45.25 31.5,45.25 25,51.75 | 25,51.75 25.12,51.88 24.75,51.88 24.75,52 | 24.75,52 25.25,52 | 25.25,52 25.25,51.88 25.12,51.75 | 25.12,51.75 25,51.62 25,51.88 25.25,52.12 25.25,52 | 25.12,51.75 25,51.75 | 25,51.75 24.75,52
  Bottom 0.406: IRQ_LATCH.11 28.78,55.7 D1.C
MOSI
  Bottom 0.125: PORT3.A23(SLOWCLKMOSI) 81.62,12.12 79.25,12.12 78.62,11.12 67.12,11.12 65.25,13 PORT2.A23(SLOWCLKMOSI) 61.62,12.12 59.25,12.12 58.62,11.12 47.12,11.12 45.25,13 PORT1.A23(SLOWCLKMOSI) 41.62,12.12 39.25,12.12 38.62,11.12 27,11.12 25.12,13 PORT0.A23(SLOWCLKMOSI)
N$1
  Bottom 0.125: BUSMASTER.3 75.48,59.75 73.25,59.75 72.75,60.25 56,60.25 55.25,59.5 55.25,58.12
  Bottom 0.406: INTACK_LATCH.14 55.28,58.16 55.25,58.12
N$2
  Bottom 0.125: PORT1.A12(TDI) 44.25,24.38 41.75,26.38 40.75,26.38 39.75,25.62 32.47,25.62 IC6.1 32.34,25.5 31.88,25.5 31.25,24.62 27.5,24.62 25.62,23 PORT0.A13(TDO) 21,23.5 19.5,24.5 18,25.25 16.62,24.62 IC5.2
N$3  (via drill 0.5)  (1 unrouted)
  Top 0.125: BUSMASTER.1 76.77,55.98
  Top 0.406: v22.5,67.25 31.88,67.25 v43.75,55.25 59.12,55.25 61.12,57.25 75.5,57.25 76.77,55.98
  Bottom 0.125: 22.43,67.44 v22.5,67.25 | 43.75,52.25 44,52 43.88,52
  Bottom 0.406: IRQ_LATCH.1 22.43,67.44 | v43.75,55.25 43.75,52.25
N$4
  Bottom 0.125: BUSMASTER.7 75.61,62.38 53.25,62.38 51.5,60.62 51.5,58.23 INTACK_LATCH.11
N$5
  Top 0.406: JTAG.2 SJ1.2
N$6
  Bottom 0.125: PORT2.A12(TDI) 64.25,24.38 61.75,26.38 60.75,26.38 59.75,25.62 52.59,25.62 IC8.1 52.47,25.5 52.12,25.5 51.25,24.62 47.38,24.62 45.75,23 PORT1.A13(TDO) 41.12,23.38 39.5,24.62 38,25.12 36.5,24.62 IC6.2
N$7
  Bottom 0.125: PORT3.A12(TDI) 84.25,24.38 81.75,26.38 80.75,26.38 79.75,25.62 73.34,25.62 IC7.1 72.95,25.57 72,24.62 67.38,24.62 65.75,23 PORT2.A13(TDO) | PORT2.A13(TDO) 63.75,23 | PORT2.A13(TDO) 61.25,23.25 59.5,24.62 58,25.12 56.38,24.62 IC8.2
N$8  (1 unrouted)
  Bottom 0.125: IRQ_LATCH.4 | IRQ_LATCH.6 28.88,69.6 | 30.12,63.5 30,63.5
  Bottom 0.406: IRQ_LATCH.3 24.97,70.97 | 24.97,70.97 25.25,71.25 26,71.25 26.25,71 | 26.25,71 IRQ_LATCH.4 | IRQ_LATCH.5 27.51,70.99 | 27.51,70.99 27.25,71.25 26.5,71.25 26.25,71 | IRQ_LATCH.6 28.78,70.97 28.5,71.25 27.77,71.25 27.51,70.99 | R7.1 20.62,70.88 21,71.25 24.69,71.25 24.97,70.97 | 28.88,69.6 28.88,66.75 30.12,65.5 30.12,63.5
N$9
  Bottom 0.125: INTACK_LATCH.12 52.74,61.12 53.75,62.12 75.64,62.12 BUSMASTER.5
N$10
  Bottom 0.125: 41.16,59.75 41.28,59.62
  Bottom 0.406: PRSNT_LATCH.14 41.28,59.62 41.28,60.38 R12.1 | PRSNT_LATCH.13 40.01,59.51 | 40.01,59.51 40.25,59.75 41.16,59.75 | PRSNT_LATCH.12 38.74,59.49 | 38.74,59.49 39,59.75 39.77,59.75 40.01,59.51 | PRSNT_LATCH.11 37.47,59.47 | 37.47,59.47 37.75,59.75 38.48,59.75 38.74,59.49 | PRSNT_LATCH.10 36.2,59.45 36.5,59.75 37.19,59.75 37.47,59.47
N$11  (via drill 0.5)
  Top 0.406: v30.38,60 v19.25,60
  Bottom 0.125: v19.25,60 19,60
  Bottom 0.406: D1.A D4.A D2.A D3.A 20.62,61 | 20.62,61 R5.1 | BUSMASTER.9 75.44,64.75 37.62,64.75 32.88,60 v30.38,60 | 19,60 18.75,60.25 18.75,60.62 19.12,61 20.62,61
N$13
  Bottom 0.406: PRSNT_LATCH.9 34.93,60.8 37.66,63.54 BUSMASTER.8
N$17
  Bottom 0.125: 31.37,63.5 IRQ_LATCH.9 | 74.25,66.12 74.25,66.1 BUSMASTER.10
  Bottom 0.406: 31.37,63.5 35.12,63.5 37.75,66.12 74.25,66.12
PPS
  Bottom 0.125: PORT3.A26(PPS) 82,10 81.25,9.25 81.25,8.75 80.62,8.12 79.25,8.12 78.75,8.88 77.25,8.88 76.62,8 67.38,8 65.25,10 PORT2.A26(PPS) 62,10 61.25,9.25 61.25,8.88 60.5,8.12 59.25,8.12 58.75,8.88 57.12,8.88 56.62,8 47.25,8 45.25,10 PORT1.A26(PPS) 42,10 41.25,9.25 41.25,8.75 40.62,8.12 39.25,8.12 38.75,8.88 37.25,8.88 36.62,8 27.38,8 25.25,10 PORT0.A26(PPS)
PRSNT0
  Bottom 0.125: R1.2 15.72,33.6 17.12,35 18.5,35 19.5,36 21.5,36 PORT0.A01(PRSNT1)
  Bottom 0.305: PRSNT_LATCH.6 37.47,41.59 30.75,35 24,35 22.88,36.12 22.88,36.62 PORT0.A01(PRSNT1)
  Bottom 0.406: IC5.4 11.15,23.62 10,23.62 9.25,24.38 9.25,31.88 10.97,33.6 R1.2
PRSNT1  (via drill 0.5)
  Top 0.406: v29,23.75 28.5,24.38 28.5,25 30.62,27 v30.62,33.25
  Bottom 0.305: PRSNT_LATCH.5 38.74,40.76 | 38.74,40.76 PORT1.A01(PRSNT1) | 32.5,34.52 38.74,40.76
  Bottom 0.406: IC6.4 29.43,23.68 v29,23.75 | v30.62,33.25 31.23,33.85 R2.2 32.5,34.52
PRSNT2  (via drill 0.5)  (1 unrouted)
  Top 0.406: v49,23.75 48.62,24.25 48.62,25.12 50.62,26.88 v50.62,33.38
  Bottom 0.125: 52.5,40.12 52.38,40.25
  Bottom 0.305: PRSNT_LATCH.4 40.01,43.24 43,40.25 52.38,40.25 59.38,40.25 62.62,37 | R3.2 52.5,40.12
  Bottom 0.406: IC8.4 50,23.75 v49,23.75 | v50.62,33.38 51.1,33.85 R3.2
PRSNT3  (via drill 0.5)
  Top 0.406: v69.25,23.75 68.88,24.25 68.88,25 71.12,27.25 v71.12,33.38
  Bottom 0.305: PRSNT_LATCH.3 41.28,43.47 43.62,41.12 73.38,41.12 | 73.38,41.12 78.38,41.12 PORT3.A01(PRSNT1) | R4.2 73.38,41.12
  Bottom 0.406: IC7.4 70.25,23.75 v69.25,23.75 | v71.12,33.38 71.72,33.85 R4.2
RX+
  Bottom 0.125: R10.2 88.47,16 PORT3.A20(BUS1+) 84.38,16.12 79.25,16.12 78.62,15.12 65.38,15.12 PORT2.A20(BUS1+) 64.38,16.12 59.25,16.12 58.62,15.12 45.38,15.12 PORT1.A20(BUS1+) 44.38,16.12 39.25,16.12 38.62,15.12 25.38,15.12 PORT0.A20(BUS1+) 22.12,16 22,16.12 19.5,16.12 18.5,15.12 14.47,15.12 13.72,15.88 R8.2
RX-
  Bottom 0.125: R10.1 PORT3.A21(BUS1-) 81.62,15.88 79.38,15.88 78.75,14.88 65.25,14.88 65.12,15 PORT2.A21(BUS1-) 61.62,15.88 59.38,15.88 58.75,14.88 45.25,14.88 45.12,15 PORT1.A21(BUS1-) 41.62,15.88 39.38,15.88 38.75,14.88 25.25,14.88 25.12,15 PORT0.A21(BUS1-) 21.62,15.88 19.62,15.88 18.62,14.88 13,14.88 12.03,15.85 R8.1
SHIFT  (via drill 0.5)
  Top 0.406: v25,66 30.5,66 v42.5,54.12 59.38,54.12 61.17,55.92 BUSMASTER.2
  Bottom 0.125: 42.5,52.1 PRSNT_LATCH.2
  Bottom 0.406: IRQ_LATCH.2 23.7,68.3 v25,66 | v42.5,54.12 42.5,52.1
TCK
  Bottom 0.125: JTAG.7 86.46,21.96 85.5,21 PORT3.A15(TCK) 81.62,21.88 79.25,21.88 78.75,21.12 65.38,21.12 65.25,21 PORT2.A15(TCK) 61.62,21.88 59.25,21.88 58.75,21.12 45.38,21.12 45.25,21 PORT1.A15(TCK) 41.62,21.88 39.25,21.88 38.75,21.12 25.38,21.12 25.25,21 PORT0.A15(TCK)
TDI
  Top 0.125: PORT0.A12(TDI) 24.88,24 29.88,19 38.5,19 39.5,20 43,20 44,19 58.5,19 59.5,20 63,20 64,19 78.5,19 79.5,20 83,20 84,21 87.12,21 89,22.88 89,26.35 JTAG.1
  Bottom 0.125: PORT0.A12(TDI) 24.12,24.62 21.75,26.38 20.75,26.38 19.75,25.62 13.84,25.62 IC5.1
TDO
  Bottom 0.125: JTAG.3 89.54,27.04 85.5,23 PORT3.A13(TDO) 81.12,23.38 79.5,24.62 78,25.12 76.5,24.62 IC7.2
TMS
  Bottom 0.125: JTAG.5 88,24.5 85.5,22 PORT3.A14(TMS) 84.38,22.12 79.25,22.12 78.75,23 77.25,23 76.62,22 PORT2.A14(TMS) 64.38,22.12 59.25,22.12 58.62,23 57.25,23 56.62,22 PORT1.A14(TMS) 44.38,22.12 39.25,22.12 38.75,23 37.25,23 36.5,22 PORT0.A14(TMS)
TRST
  Bottom 0.125: JTAG.9 90.58,19.42 90,20 PORT3.A16(TRST) 84.38,20.12 79.25,20.12 78.75,20.88 77.25,20.88 76.62,20 PORT2.A16(TRST) 64.38,20.12 59.25,20.12 58.75,20.88 57.25,20.88 56.75,20 PORT1.A16(TRST) 44.38,20.12 39.25,20.12 38.75,20.88 37.25,20.88 36.5,20 PORT0.A16(TRST)
TX+
  Bottom 0.125: R9.2 88.6,18 PORT3.A18(BUS0+) 84.38,18.12 79.25,18.12 78.75,18.88 65.5,18.88 PORT2.A18(BUS0+) 64.38,18.12 59.25,18.12 58.75,18.88 45.5,18.88 PORT1.A18(BUS0+) 44.38,18.12 39.25,18.12 38.75,18.88 25.38,18.88 PORT0.A18(BUS0+) 22.12,18 22,17.88 19.5,17.88 18.5,18.88 14.47,18.88 R6.2
TX-
  Bottom 0.125: R9.1 87.62,19 87.62,18.88 87.75,19 R9.1 | R9.1 PORT3.A17(BUS0-) 81.62,19.88 79.25,19.88 78.75,19.12 65.38,19.12 65.25,19 PORT2.A17(BUS0-) 61.62,19.88 59.25,19.88 58.75,19.12 45.38,19.12 45.25,19 PORT1.A17(BUS0-) 41.62,19.88 39.25,19.88 38.75,19.12 25.25,19.12 25.12,19 PORT0.A17(BUS0-) 21.62,18.12 19.62,18.12 18.62,19.12 13.03,19.12 R6.1

### Text on the board
Top: busmaster | hgg friendship0 | (CC-BY-NC-SA 3.0) 2012 | hadez@hgg.aero | armin@hgg.aero | JTAG | port3 | port2 | port1 | port0
Bottom: IRQ | PRSNT | INTACK | port0